# EAGLE design habexfemto (EAGLE 6.4)

## Sheet 1 of 3
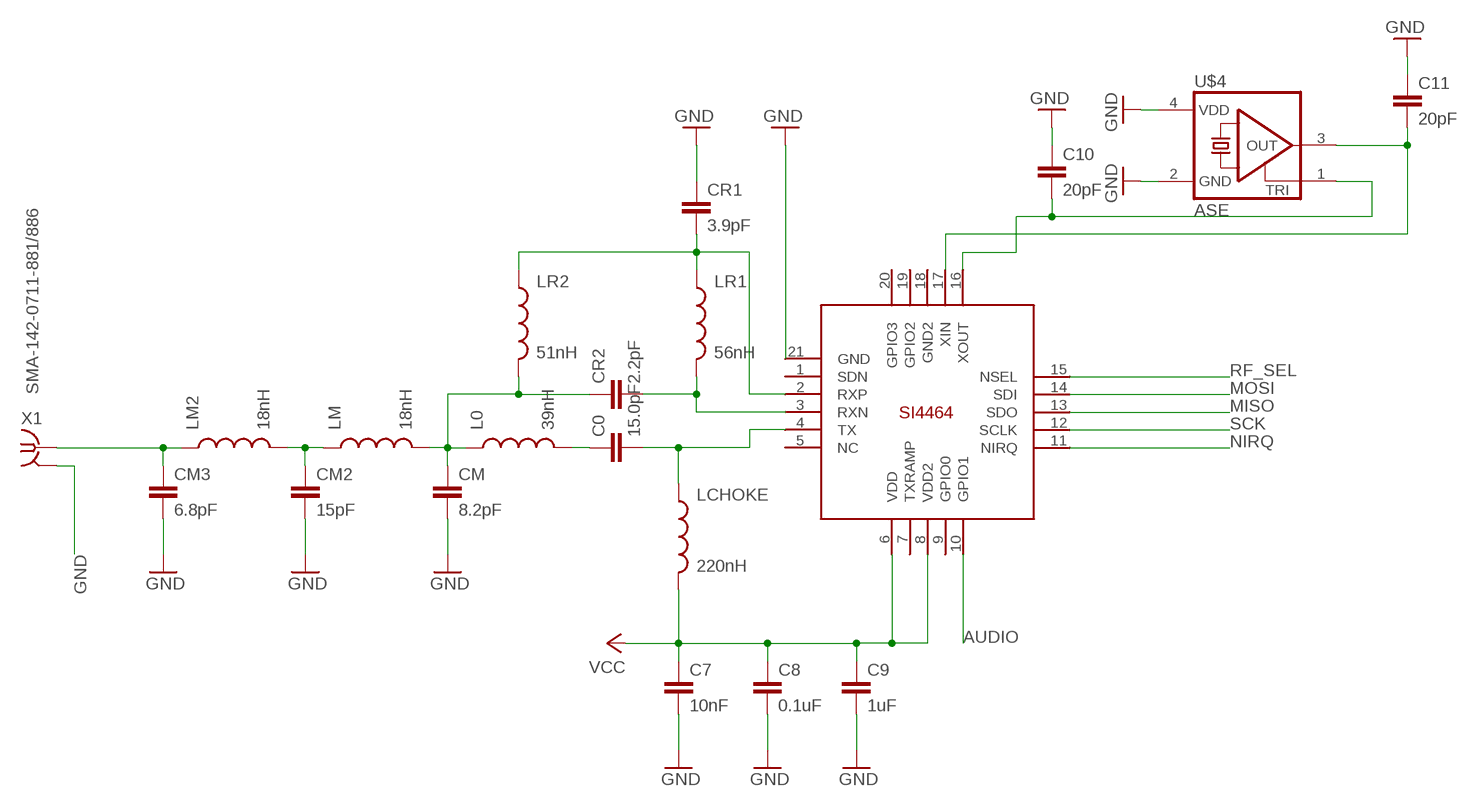
[diagram p0: schematic, sheet 1]

### Parts
C0  15.0pF  CAP0402-CAP  [0402-CAP]
C7  10nF  CAP0402-CAP  [0402-CAP]
C8  0.1uF  CAP0402-CAP  [0402-CAP]
C9  1uF  CAP0402-CAP  [0402-CAP]
C10  20pF  CAP0402-CAP  [0402-CAP]
C11  20pF  CAP0402-CAP  [0402-CAP]
CM  8.2pF  CAP0402-CAP  [0402-CAP]
CM2  15pF  CAP0402-CAP  [0402-CAP]
CM3  6.8pF  CAP0402-CAP  [0402-CAP]
CR1  3.9pF  CAP0402-CAP  [0402-CAP]
CR2  2.2pF  CAP0402-CAP  [0402-CAP]
L0  39nH  INDUCTOR0402  [C0402]
LCHOKE  220nH  INDUCTOR0402  [C0402]
LM  18nH  INDUCTOR0402  [C0402]
LM2  18nH  INDUCTOR0402  [C0402]
LR1  56nH  INDUCTOR0402  [C0402]
LR2  51nH  INDUCTOR0402  [C0402]
U$1  SI4464  [QFN20+GNDPAD]
U$4  ASE  [ASE]
X1  SMA-142-0711-881/886  [J502-ND-142-0711-881/886]

### Nets
AUDIO: U$1.10(GPIO1) ; also sheet 3
CR2: CM.1 CR2.1 L0.1 LM.2 LR2.2
GND: C7.2 C8.2 C9.2 C10.1 C11.1 CM2.2 CM3.2 CM.2 CR1.1 U$1.21(GND) U$4.2(GND) U$4.4(VDD) X1.G@1 X1.G@2 X1.G@3 X1.G@4 ; also sheet 2,3
MISO: U$1.13(SDO) ; also sheet 3
MOSI: U$1.14(SDI) ; also sheet 3
N$1: C0.2 LCHOKE.1 U$1.4(TX)
N$2: CR2.2 LR1.2 U$1.3(RXN)
N$3: CR1.2 LR1.1 LR2.1 U$1.2(RXP)
N$5: C0.1 L0.2
N$6: C11.2 U$1.17(XIN) U$4.3(OUT)
N$7: CM2.1 LM2.2 LM.1
N$8: CM3.1 LM2.1 X1.1
N$9: C10.2 U$1.16(XOUT) U$4.1(TRI)
NIRQ: U$1.11(NIRQ) ; also sheet 3
RF_SEL: U$1.15(NSEL) ; also sheet 3
SCK: U$1.12(SCLK) ; also sheet 3
VCC: C7.1 C8.1 C9.1 LCHOKE.2 U$1.6(VDD) U$1.8(VDD2) ; also sheet 2,3
Unconnected: U$1.1(SDN) U$1.5(NC ) U$1.7(TXRAMP) U$1.9(GPIO0) U$1.18(GND2) U$1.19(GPIO2) U$1.20(GPIO3)

## Sheet 2 of 3
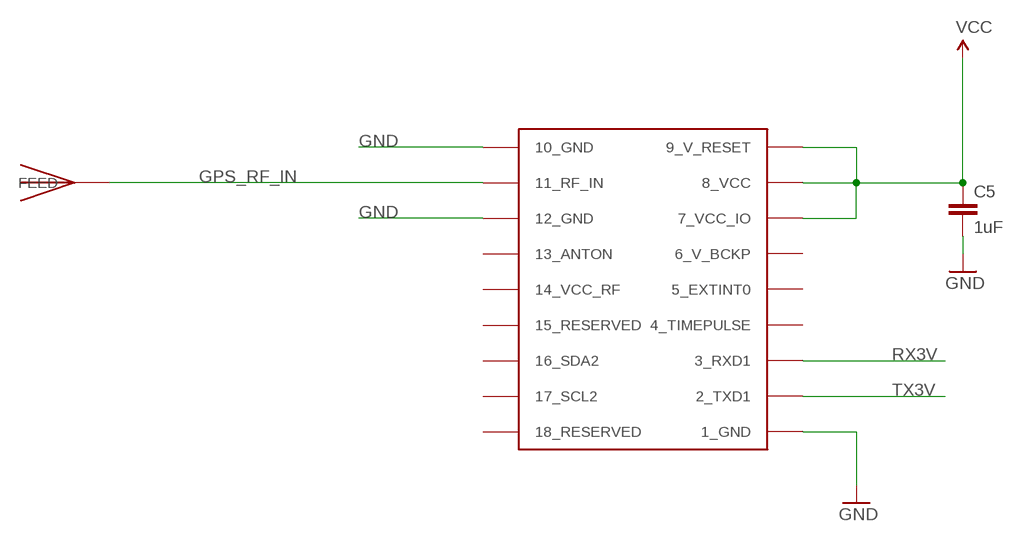
[diagram p1: schematic, sheet 2]

### Parts
C5  1uF  CAP0402-CAP  [0402-CAP]
U$2  UBLOX_MAX-6  [UBLOX_MAX-6]
U$3  JTI_ANTENNA-1575AT43A40  [JTI_ANTENNA-1575AT43A40]

### Nets
GND: C5.2 U$2.1_GND U$2.10_GND U$2.12_GND ; also sheet 1,3
GPS_RF_IN: U$2.11_RF_IN U$3.FEED
RX3V: U$2.3_RXD1 ; also sheet 3
TX3V: U$2.2_TXD1 ; also sheet 3
VCC: C5.1 U$2.7_VCC_IO U$2.8_VCC U$2.9_V_RESET ; also sheet 1,3
Unconnected: U$2.4_TIMEPULSE U$2.5_EXTINT0 U$2.6_V_BCKP U$2.13_ANTON U$2.14_VCC_RF U$2.15_RESERVED U$2.16_SDA2 U$2.17_SCL2 U$2.18_RESERVED

## Sheet 3 of 3
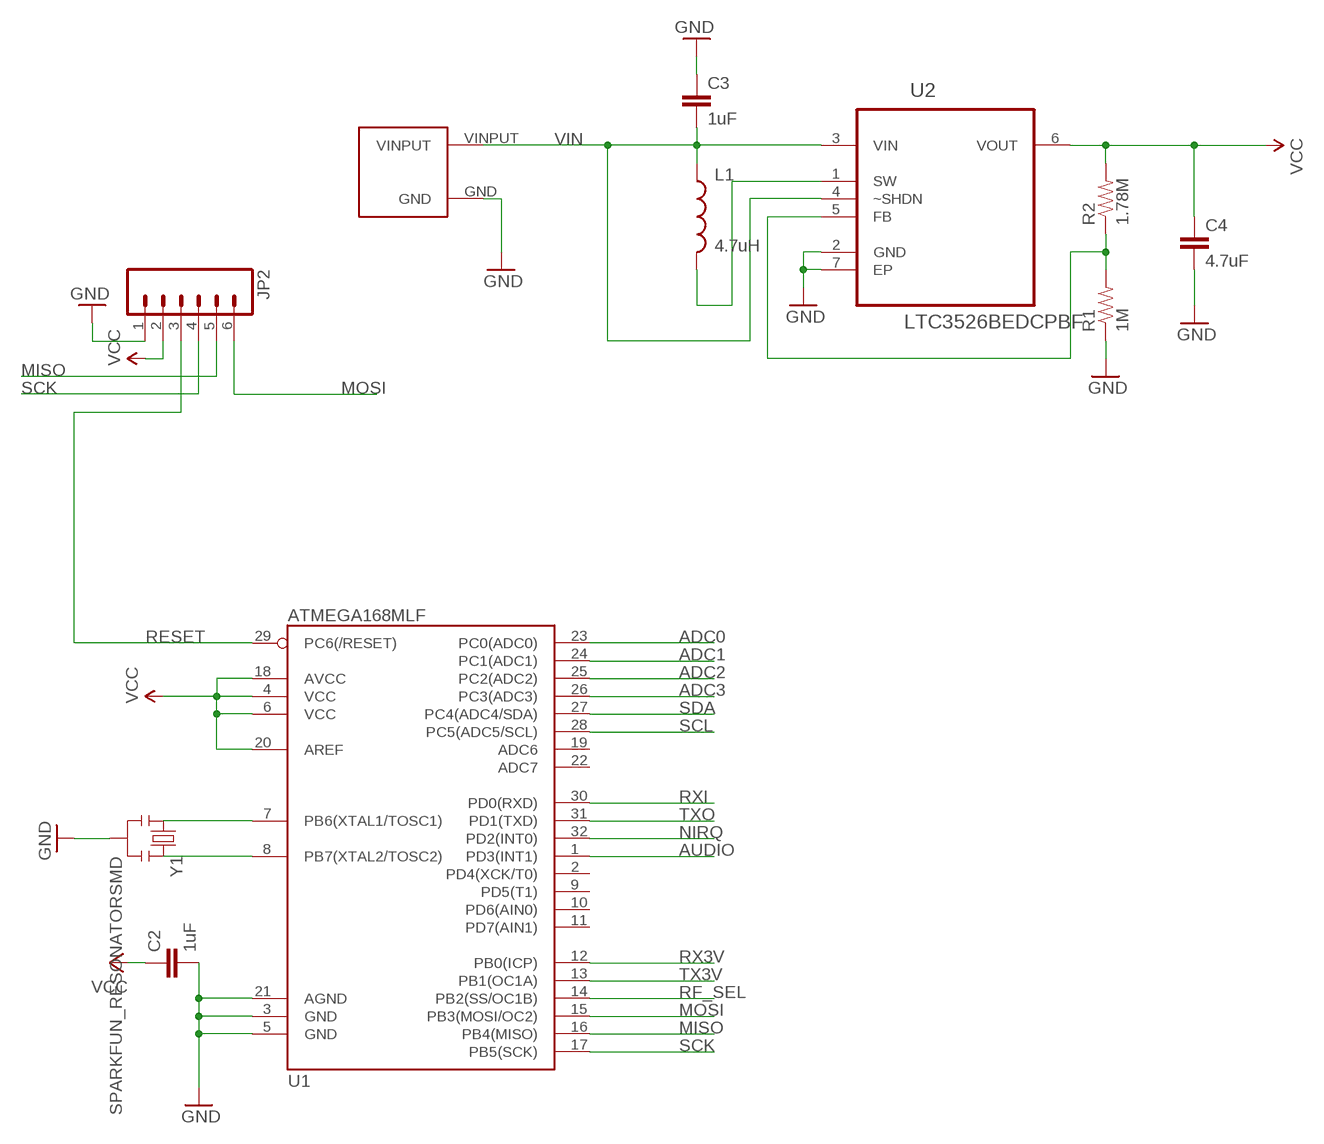
[diagram p2: schematic, sheet 3]

### Parts
C2  1uF  CAP0402-CAP  [0402-CAP]
C3  1uF  CAP0402-CAP  [0402-CAP]
C4  4.7uF  CAP0402-CAP  [0402-CAP]
JP2  M06EM406  [EM406]
L1  4.7uH  INDUCTOR0603  [0603]
R1  1M  RESISTOR0402-RES  [0402-RES]
R2  1.78M  RESISTOR0402-RES  [0402-RES]
U1  ATMEGA168MLF  [MLF32]
U2  LTC3526BEDCPBF  [DFN200X200X80-7N]
U$5  POWERPADS  [POWERPADS]
Y1  SPARKFUN_RESONATORSMD  [SPARKFUN_RESONATOR-SMD]

### Nets
ADC0: U1.23(PC0(ADC0))
ADC1: U1.24(PC1(ADC1))
ADC2: U1.25(PC2(ADC2))
ADC3: U1.26(PC3(ADC3))
AUDIO: U1.1(PD3(INT1)) ; also sheet 1
GND: C2.2 C3.1 C4.2 JP2.1 R1.1 U1.3(GND) U1.5(GND) U1.21(AGND) U2.2(GND) U2.7(EP) U$5.GND Y1.2 ; also sheet 1,2
MISO: JP2.5 U1.16(PB4(MISO)) ; also sheet 1
MOSI: JP2.6 U1.15(PB3(MOSI/OC2)) ; also sheet 1
N$4: U1.7(PB6(XTAL1/TOSC1)) Y1.1
N$10: U1.8(PB7(XTAL2/TOSC2)) Y1.3
N$12: L1.2 U2.1(SW)
N$14: R1.2 R2.1 U2.5(FB)
NIRQ: U1.32(PD2(INT0)) ; also sheet 1
RESET: JP2.3 U1.29(PC6(/RESET))
RF_SEL: U1.14(PB2(SS/OC1B)) ; also sheet 1
RX3V: U1.12(PB0(ICP)) ; also sheet 2
RXI: U1.30(PD0(RXD))
SCK: JP2.4 U1.17(PB5(SCK)) ; also sheet 1
SCL: U1.28(PC5(ADC5/SCL))
SDA: U1.27(PC4(ADC4/SDA))
TX3V: U1.13(PB1(OC1A)) ; also sheet 2
TXO: U1.31(PD1(TXD))
VCC: C2.1 C4.1 JP2.2 R2.2 U1.4(VCC) U1.6(VCC) U1.18(AVCC) U1.20(AREF) U2.6(VOUT) ; also sheet 1,2
VIN: C3.2 L1.1 U2.3(VIN) U2.4(~SHDN) U$5.VINPUT
Unconnected: U1.2(PD4(XCK/T0)) U1.9(PD5(T1)) U1.10(PD6(AIN0)) U1.11(PD7(AIN1)) U1.19(ADC6) U1.22(ADC7)

## Library data of the parts
C0 C2-C5 C7-C11 CM CM2 CM3 CR1 CR2 = SparkFun:CAP: Capacitor Standard 0603 ceramic capacitor, and 0.1" leaded capacitor.
JP2 = SparkFun:M06: Header 6 Standard 6-pin 0.1" header. Use with straight break away headers (SKU : PRT-00116), right angle break away headers (PRT-00553), swiss pins (PRT-00743), machine pins (PRT-00117), and female headers (PRT-00115). Molex polarized connector foot print use with SKU : PRT-08094 with associated crimp pins and housings. NOTES ON THE VARIANTS LOCK and LOCK_LONGPADS... This footprint was designed to help hold the alignment of a through-hole component (i.e. 6-pin header) while soldering it into place. You may notice that each hole has been shifted either up or down by 0.005 of an inch from it's more standard position (which is a perfectly straight line). This slight alteration caused the pins (the squares in the middle) to touch the edges of the holes. Because they are alternating, it causes a "brace" to hold the component in place. 0.005 has proven to be the perfect amount of "off-center" position when using our standard breakaway headers. Although looks a little odd when you look at the bare footprint, once you have a header in there, the alteration is very hard to notice. Also, if you push a header all the way into place, it is covered up entirely on the bottom side. This idea of altering the position of holes to aid alignment will be further integrated into the Sparkfun Library for other footprints. It can help hold any component with 3 or more connection pins.
L0 L1 LCHOKE LM LM2 LR1 LR2 = SparkFun:INDUCTOR: Inductors Basic Inductor/Choke - 0603 and 1206. Footprints are not proven and vary greatly between part numbers.
R1 R2 = SparkFun:RESISTOR: Resistor Basic schematic elements and footprints for 0603, 1206, and PTH resistors.
U1 = SparkFun:ATMEGA168
U2 = Ava:LTC3526BEDCPBF: Low Dropout Linear Regulators; MPN: LTC3526BEDC#PBF; OC_FARNELL: 1858699; OC_NEWARK: 61R9521; PACKAGE: DFN-6; SUPPLIER: Linear Technology
U$1 = Ava:SI4464
U$2 = Ava:UBLOX_MAX-6: UBLOX MAX-6
U$3 = Ava:JTI_ANTENNA-1575AT43A40
U$4 = crystal:ASE: 3.3Vdc CMOS SMD CRYSTAL CLOCK OSCILLATOR SOurce: www.abracon.com; OC_FARNELL: unknown; OC_NEWARK: unknown
U$5 = arko:POWERPADS
X1 = con-coax:SMA-: SMA 50 Ohm End Launch Jack Receptacle - Round Contact Johnson Components Source: www.johnsoncomponents.com .. J502-ND.pdf; MF: JOHNSON COMPONENTS; MPN: 142-0711-881; OC_FARNELL: unknown; OC_NEWARK: 50B4464
Y1 = Arduino-Pro-v14:SPARKFUN_RESONATOR: Resonator Small SMD resonator. This is the itty bitty 10/20MHz resonators with built in caps. CSTCE10M0G55 and CSTCE20M0V53. Footprint has been reviewed closely but hasn t been tested yet.'

## Board
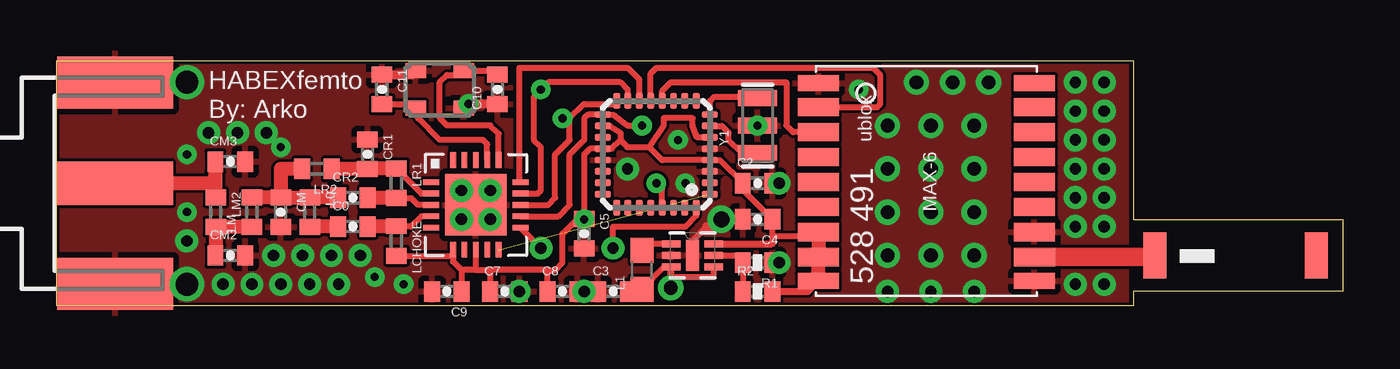
[diagram p3: board, top side]
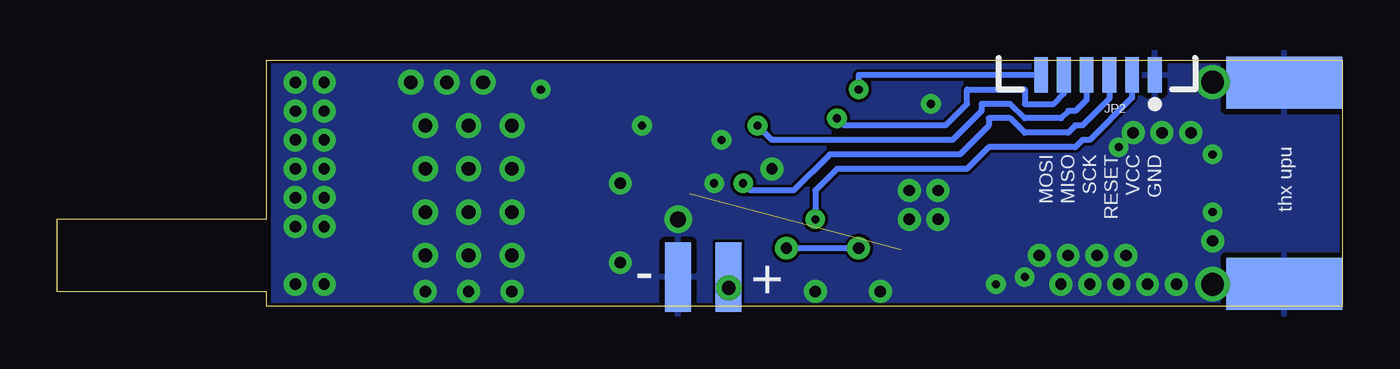
[diagram p4: board, bottom side, seen from below]

Size 56.52 x 10.79 mm. Coordinates in mm from the lower left corner, seen from the top.
Outline: 0,0 0,10.79 47.31,10.79 47.31,3.81 56.52,3.81 56.52,0.64 47.31,0.64 47.31,0 0,0
Copper layers (1*16): Top 0.035mm / dielectric 1.5mm / Bottom 0.035mm
Design rules "SparkFun *": minimum track width 8mil, minimum drill 20mil, track to track 5mil, track to pad 5mil, pad to pad 5mil, via to via 5mil, smd to smd 8mil, copper to edge 5mil, drill to drill 5mil, minimum pad ring 12mil, minimum via ring 10mil, stop-mask expansion 4mil, vias tented up to drill 25mil, thermal gap 10mil

### Footprints (pad centres in the part's own frame; a part is rotated, then mirrored left to right if it is on the bottom)
0402-CAP = smd 0.7 x 0.9: 1 -0.65,0; 2 0.65,0
EM406 = smd 0.6 x 1.55: 1 0,0; 2 1,0; 3 2,0; 4 3,0; 5 4,0; 6 5,0
C0402 = smd 0.7 x 0.9: 1 -0.65,0; 2 0.65,0
0603 = smd 1.1 x 1: 1 -0.85,0; 2 0.85,0
0402-RES = smd 0.7 x 0.9: 1 -0.65,0; 2 0.65,0
MLF32 = smd 0.7 x 0.3: 1 -2.35,1.75; 2 -2.35,1.25; 3 -2.35,0.75; 4 -2.35,0.25; 5 -2.35,-0.25; 6 -2.35,-0.75; 7 -2.35,-1.25; 8 -2.35,-1.75; 17 2.35,-1.75; 18 2.35,-1.25; 19 2.35,-0.75; 20 2.35,-0.25; 21 2.35,0.25; 22 2.35,0.75; 23 2.35,1.25; 24 2.35,1.75 | smd 0.3 x 0.7: 9 -1.75,-2.35; 10 -1.25,-2.35; 11 -0.75,-2.35; 12 -0.25,-2.35; 13 0.25,-2.35; 14 0.75,-2.35; 15 1.25,-2.35; 16 1.75,-2.35; 25 1.75,2.35; 26 1.25,2.35; 27 0.75,2.35; 28 0.25,2.35; 29 -0.25,2.35; 30 -0.75,2.35; 31 -1.25,2.35; 32 -1.75,2.35
DFN200X200X80-7N = smd 0.813 x 0.305: 1 -0.94,0.508; 2 -0.94,0; 3 -0.94,-0.508; 4 0.94,-0.508; 5 0.94,0; 6 0.94,0.508 | smd 0.559 x 1.372: 7 0,0
QFN20+GNDPAD = smd 0.7 x 0.25: 1 -1.97,1; 2 -1.97,0.5; 3 -1.97,0; 4 -1.97,-0.5; 5 -1.97,-1; 11 1.97,-1; 12 1.97,-0.5; 13 1.97,0; 14 1.97,0.5; 15 1.97,1 | smd 0.25 x 0.7: 6 -1,-1.97; 7 -0.5,-1.97; 8 0,-1.97; 9 0.5,-1.97; 10 1,-1.97; 16 1,1.97; 17 0.5,1.97; 18 0,1.97; 19 -0.5,1.97; 20 -1,1.97 | smd 2.7 x 2.7: 21 0,0
UBLOX_MAX-6 = smd 1.8 x 0.7: 1_GND 4.95,-4.4; 9_V_RESET 4.95,4.3; 10_GND -4.55,4.3; 18_RESERVED -4.55,-4.4 | smd 1.8 x 0.8: 2_TXD1 4.95,-3.35; 3_RXD1 4.95,-2.25; 4_TIMEPULSE 4.95,-1.15; 5_EXTINT0 4.95,-0.05; 6_V_BCKP 4.95,1.05; 7_VCC_IO 4.95,2.15; 8_VCC 4.95,3.25; 11_RF_IN -4.55,3.25; 12_GND -4.55,2.15; 13_ANTON -4.55,1.05; 14_VCC_RF -4.55,-0.05; 15_RESERVED -4.55,-1.15; 16_SDA2 -4.55,-2.25; 17_SCL2 -4.55,-3.35
JTI_ANTENNA-1575AT43A40 = smd 1 x 2: FEED -3.175,0; NC 3.925,0
ASE = smd 0.9 x 0.65: 1 -1.05,-0.825; 2 1.05,-0.825; 3 1.05,0.825; 4 -1.05,0.825
POWERPADS = smd 1.143 x 3.048: GND 2.223,0; VINPUT 0,0
J502-ND-142-0711-881/886 = smd 5.08 x 1.905: 1 2.565,0 | smd 5.08 x 2.286: G@1 2.565,4.42; G@2 2.565,-4.42 | smd 5.08 x 2.286 bottom: G@3 2.565,4.42; G@4 2.565,-4.42
SPARKFUN_RESONATOR-SMD = smd 0.7 x 1.7: 1 -1.2,0; 2 0,0; 3 1.2,0

### Placement (x,y rotation side)
C0  13.02,3.49 0 top
C2  30.8,5.4 0 top
C3  24.45,0.64 0 top
C4  30.8,3.81 180 top
C5  23.18,3.17 270 top
C7  19.68,0.64 0 top
C8  22.23,0.64 0 top
C9  17.14,0.64 180 top
C10  19.37,9.53 90 top
C11  14.29,9.53 270 top
CM  9.84,4.13 270 top
CM2  7.62,2.22 0 top
CM3  7.62,6.35 0 top
CR1  13.65,6.67 270 top
CR2  13.02,4.76 0 top
JP2  8.26,10.16 180 bottom
L0  11.11,4.13 270 top
L1  25.72,1.59 90 top
LCHOKE  14.92,2.86 270 top
LM  8.57,4.13 90 top
LM2  6.99,4.13 270 top
LR1  14.92,5.4 270 top
LR2  11.43,6.03 180 top
R1  30.8,1.91 180 top
R2  30.8,0.64 0 top
U1  26.35,6.67 180 top
U2  27.94,2.22 0 top
U$1  18.41,4.45 0 top
U$2  38.42,5.4 180 top
U$3  51.44,2.22 0 top
U$4  16.83,9.53 180 top
U$5  26.99,1.27 180 bottom
X1  0,5.4 0 top
Y1  30.8,7.94 90 top

### Tracks (layer width: path | path; a pad name or v marks a point on that pad's centre or on a via)
AUDIO  (1 unrouted)
CR2
  Top 0.61: 12.37,4.78 CR2.1 11.11,4.76 L0.1 CM.1 | 8.57,4.76 LM.2 CM.1 | LR2.2 9.84,6.03 CM.1
GND  (via drill 0.36, 0.5, 0.6, 0.7, 1)
  Top 0.254: v19.05,3.81 U$1.21 v17.78,3.81 | U$4.4 17.91,8.7 v18.1,8.89 | U2.7 27.94,2.86 28.57,3.49
  Top 0.406: 28.57,3.49 28.89,3.49 v29.21,3.81 | C11.1 15.6,10.18 U$4.2 | C10.1 18.11,8.88 v18.1,8.89
  other vias: 38.42,0.64 37.78,9.84 39.37,9.84 40.96,9.84 36.51,7.94 38.42,7.94 40.32,7.94 36.51,6.03 38.42,6.03 40.32,6.03 36.51,4.13 38.42,4.13 40.32,4.13 36.51,2.22 38.42,2.22 40.32,2.22 44.77,9.84 44.77,8.57 7.94,7.62 6.67,7.62 44.77,4.76 44.77,3.49 46.04,9.84 46.04,8.57 46.04,7.3 46.04,6.03 46.04,4.76 46.04,3.49 40.32,0.64 36.51,0.64 5.71,2.86 8.57,0.95 10.79,2.22 31.75,1.91 25.08,6.03 13.34,2.22 15.24,0.95 5.71,6.67 7.3,0.95 12.06,2.22 12.38,0.95 44.77,0.95 46.04,0.95 44.77,6.03 9.53,2.22 5.71,4.13 44.77,7.3 9.21,7.62 23.18,0.64 11.11,0.95 27.3,7.3 5.71,9.84 5.71,0.95 9.84,0.95 30.8,7.94 31.75,5.4 17.78,5.08 19.05,5.08 20.32,0.64 13.97,1.27 9.84,6.99 27.62,5.4 35.24,9.53
  pour Top: -0.32,11.11 46.99,11.11 46.99,-0.32 -0.32,-0.32
  pour Bottom: -0.32,11.11 46.99,11.11 46.99,-0.32 -0.32,-0.32
GPS_RF_IN
  Top 0.813: U$2.11_RF_IN 48.19,2.15 U$3.FEED
MISO  (via drill 0.36)
  Top 0.254: U$1.13 21.59,4.45 21.91,4.76 21.91,6.67 22.54,7.3 22.54,8.26 | 22.54,8.26 23.18,8.89 24.48,8.89 U1.16 | 22.54,8.26 v22.23,8.26
  Bottom 0.254: JP2.5 12.26,9.34 12.7,8.89 13.97,8.89 13.97,9.53 16.51,9.53 16.51,8.89 17.46,7.94 21.91,7.94 v22.23,8.26
MOSI  (via drill 0.36)
  Top 0.254: U$1.14 21.14,4.95 21.27,5.08 21.27,6.99 20.95,7.3 20.95,9.21 v21.27,9.53 21.59,9.84 24.77,9.84 25.1,9.51 U1.15
  Bottom 0.254: JP2.6 21.27,10.16 v21.27,9.53
N$1
  Top 0.254: U$1.4 16.01,3.94 15.56,3.49 14.94,3.49 LCHOKE.1
  Top 0.61: LCHOKE.1 13.67,3.51 C0.2
N$2
  Top 0.254: U$1.3 15.88,4.45 15.57,4.75 LR1.2
  Top 0.61: LR1.2 13.67,4.75 CR2.2
N$3
  Top 0.254: U$1.2 16.02,4.95 LR1.1
  Top 0.61: LR1.1 13.65,6.05 CR1.2 12.08,6.02 LR2.1
N$4
  Top 0.254: Y1.1 30.09,6.74 29.53,7.3 29.53,7.62 29.23,7.92 U1.7
N$5
  Top 0.61: C0.1 11.11,3.49 L0.2
N$6
  Top 0.254: C11.2 15.6,8.88 U$4.3 15.88,8.6 15.88,8.26 16.83,7.3 18.73,7.3 18.91,7.12 U$1.17
N$7
  Top 0.61: LM.1 LM2.2 6.97,3.46 CM2.1
N$8
  Top 0.61: LM2.1 6.97,4.78 6.97,5.4 | 6.97,5.4 CM3.1 | X1.1 6.97,5.4
N$9
  Top 0.254: C10.2 19.19,10.35 U$4.1 17.69,10.16 17.14,10.16 16.83,9.84 16.83,8.26 17.14,7.94 19.05,7.94 19.41,7.57 U$1.16
N$10
  Top 0.254: U1.8 28.7,9.02 28.89,9.21 30.73,9.21 Y1.3
N$12
  Top 0.254: 25.74,2.73 L1.2 26.01,2.73 U2.1
N$14
  Top 0.254: R2.1 R1.2 30.15,2.22 U2.5
NIRQ  (via drill 0.5)
  Top 0.254: v24.45,2.54 24.45,3.49 27.62,3.49 28.1,3.97 U1.32 | U$1.11 20.39,3.43 v21.27,2.54
  Bottom 0.254: v21.27,2.54 v24.45,2.54
RESET  (via drill 0.36)
  Top 0.254: U1.29 26.6,5.15 v26.35,5.4
  Bottom 0.254: JP2.3 10.26,9.11 11.43,7.94 11.75,7.94 12.06,7.62 13.97,7.62 14.61,8.26 15.56,8.26 15.56,7.94 16.83,6.67 22.54,6.67 24.13,5.08 26.04,5.08 v26.35,5.4
RF_SEL
  Top 0.254: U1.14 25.6,9.96 25.08,10.48 20.32,10.48 20.32,5.51 U$1.15
RX3V
  Top 0.254: U1.12 26.6,9.46 26.99,9.84 32.07,9.84 32.07,7.94 32.36,7.65 U$2.3_RXD1
SCK  (via drill 0.36)
  Top 0.254: U$1.12 22.04,3.94 22.54,4.45 22.54,6.67 23.18,7.3 23.18,8.26 23.34,8.42 U1.17 24.44,8.42 25.08,7.94 v25.72,7.94
  Bottom 0.254: JP2.4 11.26,9.06 11.75,8.57 12.06,8.57 12.38,8.26 13.97,8.26 14.61,8.89 15.88,8.89 15.88,8.57 17.14,7.3 25.08,7.3 v25.72,7.94
TX3V
  Top 0.254: U1.13 26.1,10.23 26.35,10.48 35.88,10.48 36.2,10.16 36.2,8.89 36.05,8.75 U$2.2_TXD1
VCC  (via drill 0.36)
  Top 0.254: C5.1 23.18,6.67 23.43,6.92 U1.20 24.38,6.92 24.77,7.3 | C4.1 31.43,4.13 31.43,3.05 | C4.1 31.42,4.13 | C4.1 30.15,5.11 C2.1 29.13,6.42 U1.4 26.6,6.42 26.04,6.99 | 17.78,1.59 17.41,1.95 U$1.6 17.41,2.21 LCHOKE.2 | U$1.8 18.41,1.59 | 18.41,1.59 17.78,1.59 | 17.78,1.59 C9.1 | 18.41,1.59 19.05,1.59 | 19.05,1.59 C7.1 | C8.1 21.57,1.57 | 21.57,1.57 21.59,1.59 19.05,1.59 | 21.57,1.57 21.89,1.57 22.23,1.91 22.23,3.17 22.88,3.83 C5.1 | 31.43,3.05 33.27,3.05 U$2.7_VCC_IO | 31.43,3.05 31.43,2.73 | U1.18 24.31,7.92 24.77,7.62 24.77,7.3 | 24.77,7.3 25.08,6.99 26.04,6.99 | U1.6 28.14,7.42 27.94,7.94 27.94,8.26 26.67,8.26 26.67,7.94 26.04,6.99 | C5.1 v23.18,3.81
  Top 0.305: 33.4,3.17 U$2.7_VCC_IO | R2.2 33.01,0.64 U$2.9_V_RESET | U2.6 31.43,2.73
  Top 0.61: U$2.9_V_RESET U$2.8_VCC | U$2.7_VCC_IO U$2.8_VCC | 33.38,2.24 U$2.8_VCC
  Bottom 0.254: JP2.2 9.26,9.16 11.11,7.3 11.43,7.3 11.75,6.99 15.56,6.99 16.51,6.03 22.23,6.03 23.18,5.08 v23.18,3.81
VIN  (via drill 0.6)
  Top 0.254: U2.4 28.88,1.27 U$5.VINPUT 26.99,1.71 U2.3 26.7,1.71 L1.1 25.73,1.04 C3.2
  Top 0.305: U2.3 26.99,1.7 v26.99,0.79
  Top 0.61: C3.2 25.72,0.64
  Bottom 0.254: U$5.VINPUT v26.99,0.79
  Bottom 0.406: 26.99,0.59 v26.99,0.79

### Text on the board
tNames: HABEXfemto | By: Arko | 528 491
bNames: GND | VCC | RESET | SCK | MISO | MOSI | thx upu | - | +